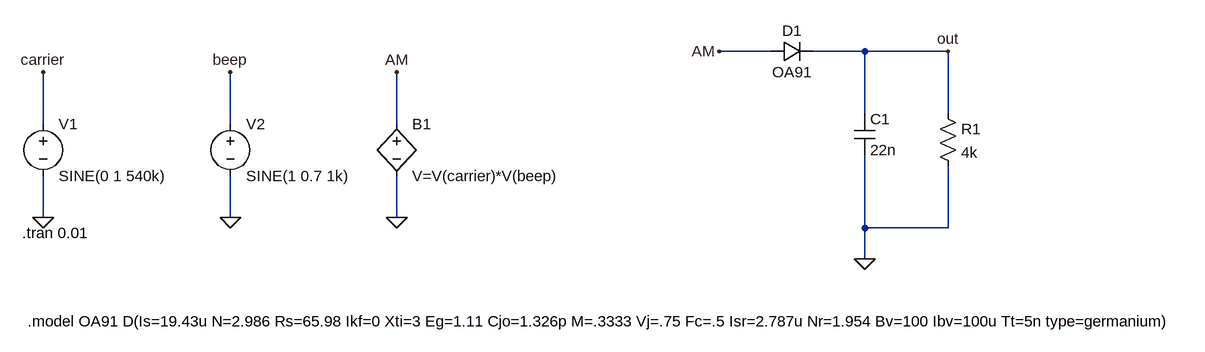
[diagram p0: schematic simple-envelope-detector.asc]
simple-envelope-detector.asc, the LTspice schematic file:
Version 4
SHEET 1 1808 680
WIRE 976 -16 896 -16
WIRE 1120 -16 1040 -16
WIRE 1248 -16 1120 -16
WIRE 1120 80 1120 -16
WIRE 1248 80 1248 -16
WIRE -144 96 -144 16
WIRE 144 96 144 16
WIRE 400 96 400 16
WIRE -144 240 -144 176
WIRE 144 240 144 176
WIRE 400 240 400 176
WIRE 1120 256 1120 144
WIRE 1248 256 1248 160
WIRE 1248 256 1120 256
WIRE 1120 304 1120 256
FLAG -144 240 0
FLAG 144 240 0
FLAG 400 240 0
FLAG -144 16 carrier
FLAG 144 16 beep
FLAG 400 16 AM
FLAG 1120 304 0
FLAG 896 -16 AM
FLAG 1248 -16 out
SYMBOL voltage -144 80 R0
WINDOW 123 0 0 Left 0
WINDOW 39 0 0 Left 0
SYMATTR InstName V1
SYMATTR Value SINE(0 1 540k)
SYMBOL voltage 144 80 R0
WINDOW 123 0 0 Left 0
WINDOW 39 0 0 Left 0
SYMATTR InstName V2
SYMATTR Value SINE(1 0.7 1k)
SYMBOL bv 400 80 R0
SYMATTR InstName B1
SYMATTR Value V=V(carrier)*V(beep)
SYMBOL cap 1104 80 R0
SYMATTR InstName C1
SYMATTR Value 22n
SYMBOL res 1232 64 R0
SYMATTR InstName R1
SYMATTR Value 4k
SYMBOL diode 976 0 R270
WINDOW 0 32 32 VTop 2
WINDOW 3 0 32 VBottom 2
SYMATTR InstName D1
SYMATTR Value OA91
TEXT -176 264 Left 2 !.tran 0.01
TEXT -168 400 Left 2 !.model OA91 D(Is=19.43u N=2.986 Rs=65.98 Ikf=0 Xti=3 Eg=1.11 Cjo=1.326p M=.3333 Vj=.75 Fc=.5 Isr=2.787u Nr=1.954 Bv=100 Ibv=100u Tt=5n type=germanium)

The netlist it stands for:
* simple-envelope-detector.asc
V1 carrier 0 SINE(0 1 540k)
V2 beep 0 SINE(1 0.7 1k)
B1 AM 0 V=V(carrier)*V(beep)
C1 out 0 22n
R1 out 0 4k
D1 AM out OA91
.model D D
.lib standard.dio
.tran 0.01
.model OA91 D(Is=19.43u N=2.986 Rs=65.98 Ikf=0 Xti=3 Eg=1.11 Cjo=1.326p M=.3333 Vj=.75 Fc=.5 Isr=2.787u Nr=1.954 Bv=100 Ibv=100u Tt=5n type=germanium)
.backanno
.end